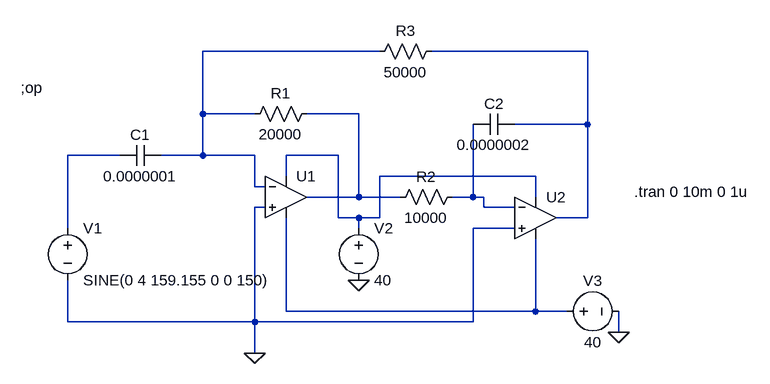
[diagram p0: schematic Lab5.asc]
Lab5.asc, the LTspice schematic file:
Version 4
SHEET 1 880 680
WIRE 176 -64 -96 -64
WIRE 496 -64 256 -64
WIRE -96 32 -96 -64
WIRE -16 32 -96 32
WIRE 144 32 64 32
WIRE 496 48 496 -64
WIRE 496 48 384 48
WIRE -224 96 -304 96
WIRE -96 96 -96 32
WIRE -96 96 -160 96
WIRE -16 96 -96 96
WIRE 112 96 32 96
WIRE 32 128 32 96
WIRE 416 128 176 128
WIRE -16 144 -16 96
WIRE 0 144 -16 144
WIRE 144 160 144 32
WIRE 144 160 64 160
WIRE 208 160 144 160
WIRE 320 160 320 48
WIRE 320 160 288 160
WIRE 336 160 320 160
WIRE 416 160 416 128
WIRE 0 176 -16 176
WIRE 336 176 336 160
WIRE 384 176 336 176
WIRE 112 192 112 96
WIRE 144 192 112 192
WIRE 176 192 176 128
WIRE 176 192 144 192
WIRE 496 192 496 48
WIRE 496 192 448 192
WIRE -304 208 -304 96
WIRE 144 208 144 192
WIRE 384 208 320 208
WIRE 32 336 32 192
WIRE 416 336 416 224
WIRE 416 336 32 336
WIRE 464 336 416 336
WIRE -304 352 -304 288
WIRE -16 352 -16 176
WIRE -16 352 -304 352
WIRE 320 352 320 208
WIRE 320 352 -16 352
WIRE 544 368 544 336
WIRE -16 400 -16 352
FLAG -16 400 0
FLAG 144 288 0
FLAG 544 368 0
SYMBOL OpAmps\\UniversalOpAmp 32 160 R0
SYMATTR InstName U1
SYMBOL OpAmps\\UniversalOpAmp 416 192 R0
SYMATTR InstName U2
SYMBOL res 80 16 R90
WINDOW 0 0 56 VBottom 2
WINDOW 3 32 56 VTop 2
SYMATTR InstName R1
SYMATTR Value 20000
SYMBOL res 304 144 R90
WINDOW 0 0 56 VBottom 2
WINDOW 3 32 56 VTop 2
SYMATTR InstName R2
SYMATTR Value 10000
SYMBOL res 272 -80 R90
WINDOW 0 0 56 VBottom 2
WINDOW 3 32 56 VTop 2
SYMATTR InstName R3
SYMATTR Value 50000
SYMBOL cap -160 80 R90
WINDOW 0 0 32 VBottom 2
WINDOW 3 32 32 VTop 2
SYMATTR InstName C1
SYMATTR Value 0.0000001
SYMBOL cap 384 32 R90
WINDOW 0 0 32 VBottom 2
WINDOW 3 32 32 VTop 2
SYMATTR InstName C2
SYMATTR Value 0.0000002
SYMBOL voltage -304 192 R0
WINDOW 123 0 0 Left 0
WINDOW 39 0 0 Left 0
SYMATTR InstName V1
SYMATTR Value SINE(0 4 159.155 0 0 150)
SYMBOL voltage 144 192 R0
WINDOW 123 0 0 Left 0
WINDOW 39 0 0 Left 0
SYMATTR InstName V2
SYMATTR Value 40
SYMBOL voltage 448 336 R270
WINDOW 0 32 56 VTop 2
WINDOW 3 -32 56 VBottom 2
WINDOW 123 0 0 Left 0
WINDOW 39 0 0 Left 0
SYMATTR InstName V3
SYMATTR Value 40
TEXT -376 -8 Left 2 !;op
TEXT 568 152 Left 2 !.tran 0 10m 0 1u

The netlist it stands for:
* Lab5.asc
XU1 0 N001 N005 N007 N003 level1 Avol=1Meg GBW=10Meg Vos=0 En=0 Enk=0 In=0 Ink=0 Rin=500Meg  ; pins In+ In- V+ V- OUT
XU2 0 N006 N005 N007 N002 level1 Avol=1Meg GBW=10Meg Vos=0 En=0 Enk=0 In=0 Ink=0 Rin=500Meg  ; pins In+ In- V+ V- OUT
R1 N003 N001 20000
R2 N006 N003 10000
R3 N002 N001 50000
C1 N001 N004 0.0000001
C2 N002 N006 0.0000002
V1 N004 0 SINE(0 4 159.155 0 0 150)
V2 N005 0 40
V3 N007 0 40
;op
.tran 0 10m 0 1u
.lib UniversalOpAmp1.lib
.backanno
.end